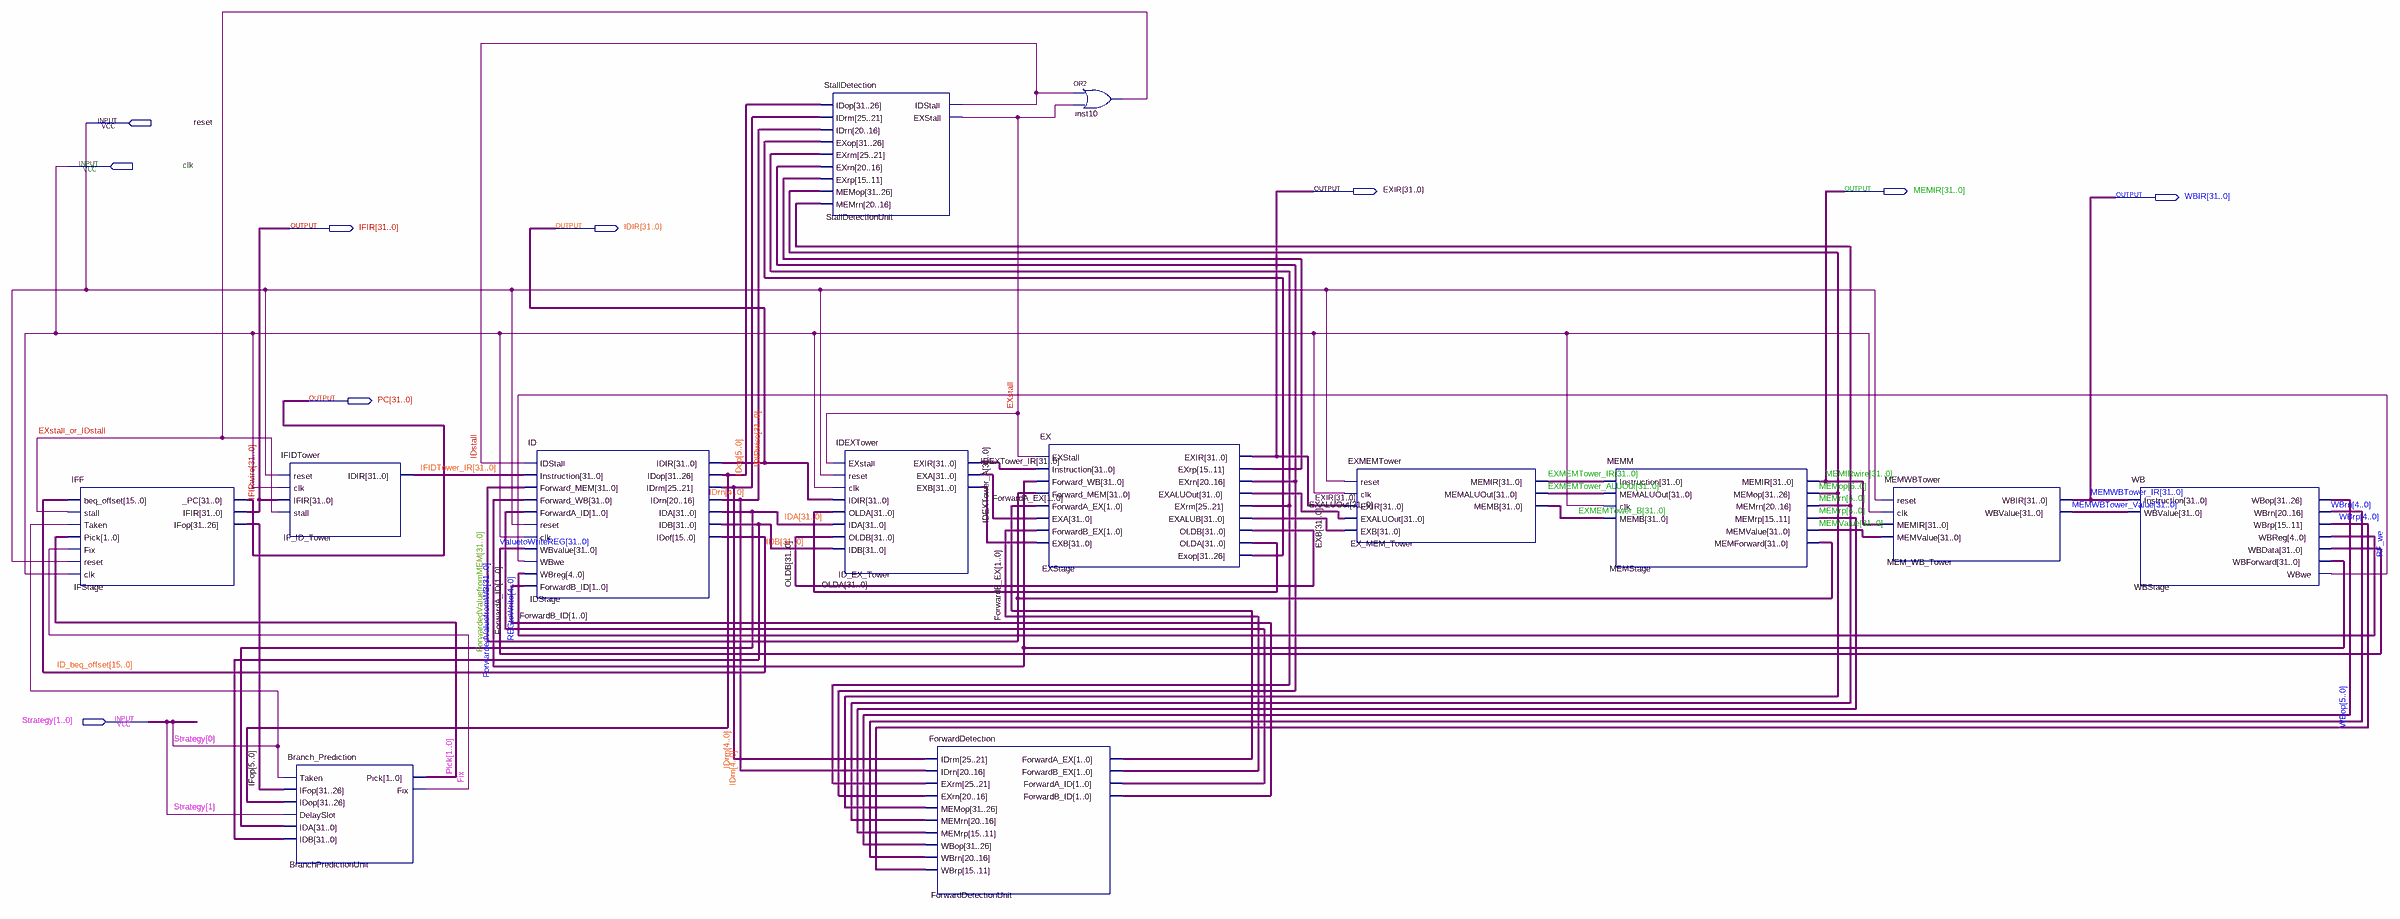
[diagram p0: schematic sheet]
// Quartus schematic CPU_Pipelined.bdf as structural Verilog: 13 symbols, 9 pins
module CPU_Pipelined (
  input  reset,
  input  clk,
  input  [1:0] Strategy,
  output [31:0] EXIR,
  output [31:0] MEMIR,
  output [31:0] WBIR,
  output [31:0] IFIR,
  output [31:0] IDIR,
  output [31:0] PC
);

  wire EXstall, EXstall_or_IDstall, Fix, IDstall, RF_we;
  wire [1:0] ForwardA_EX, ForwardA_ID, ForwardB_EX, ForwardB_ID, Pick;
  wire [4:0] EXStage_exrm, EXStage_exrn, EXStage_exrp, IDrm, IDrn, MEMrn, MEMrp, REGtoWrite, WBrn, WBrp;
  wire [5:0] EXStage_exop, IDop, IFop, MEMop, WBop;
  wire [15:0] ID_beq_offset;
  wire [31:0] EXALUOut, EXB, EXMEMTower_ALUOut, EXMEMTower_B, EXMEMTower_IR, ForwardedValuefromMEM,
       ForwardedValuefromWB, ID_EX_Tower_exb, IDA, IDB, IDEXTower_A, IDEXTower_IR, IFIDTower_IR, MEMValue,
       MEMWBTower_Value, OLDA, OLDB, ValuetoWriteREG;

  IFF IFStage (
    .beq_offset(ID_beq_offset), .stall(EXstall_or_IDstall), .Taken(Strategy[0]), .Pick(Pick), .Fix(Fix),
    .reset(reset), .clk(clk), ._PC(PC), .IFIR(IFIR), .IFop(IFop));
  IFIDTower IF_ID_Tower (.reset(reset), .clk(clk), .IFIR(IFIR), .stall(EXstall_or_IDstall), .IDIR(IFIDTower_IR));
  Branch_Prediction BranchPredictionUnit (
    .Taken(Strategy[0]), .IFop(IFop), .IDop(IDop), .DelaySlot(Strategy[1]), .IDA(IDA), .IDB(IDB),
    .Pick(Pick), .Fix(Fix));
  ID IDStage (
    .IDStall(IDstall), .Instruction(IFIDTower_IR), .Forward_MEM(ForwardedValuefromMEM),
    .Forward_WB(ForwardedValuefromWB), .ForwardA_ID(ForwardA_ID), .reset(reset), .clk(clk),
    .WBvalue(ValuetoWriteREG), .WBwe(RF_we), .WBreg(REGtoWrite), .ForwardB_ID(ForwardB_ID), .IDIR(IDIR),
    .IDop(IDop), .IDrm(IDrm), .IDrn(IDrn), .IDA(IDA), .IDB(IDB), .IDof(ID_beq_offset));
  StallDetection StallDetectionUnit (
    .IDop(IDop), .IDrm(IDrm), .IDrn(IDrn), .EXop(EXStage_exop), .EXrm(EXStage_exrm), .EXrn(EXStage_exrn),
    .EXrp(EXStage_exrp), .MEMop(MEMop), .MEMrn(MEMrn), .IDStall(IDstall), .EXStall(EXstall));
  IDEXTower ID_EX_Tower (
    .EXstall(EXstall), .reset(reset), .clk(clk), .IDIR(IDIR), .OLDA(OLDA), .IDA(IDA), .OLDB(OLDB), .IDB(IDB),
    .EXIR(IDEXTower_IR), .EXA(IDEXTower_A), .EXB(ID_EX_Tower_exb));
  ForwardDetection ForwardDetectionUnit (
    .IDrm(IDrm), .IDrn(IDrn), .EXrm(EXStage_exrm), .EXrn(EXStage_exrn), .MEMop(MEMop), .MEMrn(MEMrn),
    .MEMrp(MEMrp), .WBop(WBop), .WBrn(WBrn), .WBrp(WBrp), .ForwardA_EX(ForwardA_EX),
    .ForwardB_EX(ForwardB_EX), .ForwardA_ID(ForwardA_ID), .ForwardB_ID(ForwardB_ID));
  EX EXStage (
    .EXStall(EXstall), .Instruction(IDEXTower_IR), .Forward_WB(ForwardedValuefromWB),
    .Forward_MEM(ForwardedValuefromMEM), .ForwardA_EX(ForwardA_EX), .EXA(IDEXTower_A),
    .ForwardB_EX(ForwardB_EX), .EXB(ID_EX_Tower_exb), .EXIR(EXIR), .EXrp(EXStage_exrp), .EXrn(EXStage_exrn),
    .EXALUOut(EXALUOut), .EXrm(EXStage_exrm), .EXALUB(EXB), .OLDB(OLDB), .OLDA(OLDA), .Exop(EXStage_exop));
  or inst10 (EXstall_or_IDstall, IDstall, EXstall);
  EXMEMTower EX_MEM_Tower (
    .reset(reset), .clk(clk), .EXIR(EXIR), .EXALUOut(EXALUOut), .EXB(EXB), .MEMIR(EXMEMTower_IR),
    .MEMALUOut(EXMEMTower_ALUOut), .MEMB(EXMEMTower_B));
  MEMM MEMStage (
    .Instruction(EXMEMTower_IR), .MEMALUOut(EXMEMTower_ALUOut), .clk(clk), .MEMB(EXMEMTower_B),
    .MEMIR(MEMIR), .MEMop(MEMop), .MEMrn(MEMrn), .MEMrp(MEMrp), .MEMValue(MEMValue),
    .MEMForward(ForwardedValuefromMEM));
  MEMWBTower MEM_WB_Tower (
    .reset(reset), .clk(clk), .MEMIR(MEMIR), .MEMValue(MEMValue), .WBIR(WBIR), .WBValue(MEMWBTower_Value));
  WB WBStage (
    .Instruction(WBIR), .WBValue(MEMWBTower_Value), .WBop(WBop), .WBrn(WBrn), .WBrp(WBrp),
    .WBReg(REGtoWrite), .WBData(ValuetoWriteREG), .WBForward(ForwardedValuefromWB), .WBwe(RF_we));

  // Other names for the same wires on the sheet: IDIRwire[31:0] = IDIR; IFIRwire[31:0] = IFIR;
  //   MEMIRwire[31:0] = MEMIR; MEMWBTower_IR[31:0] = WBIR
endmodule
